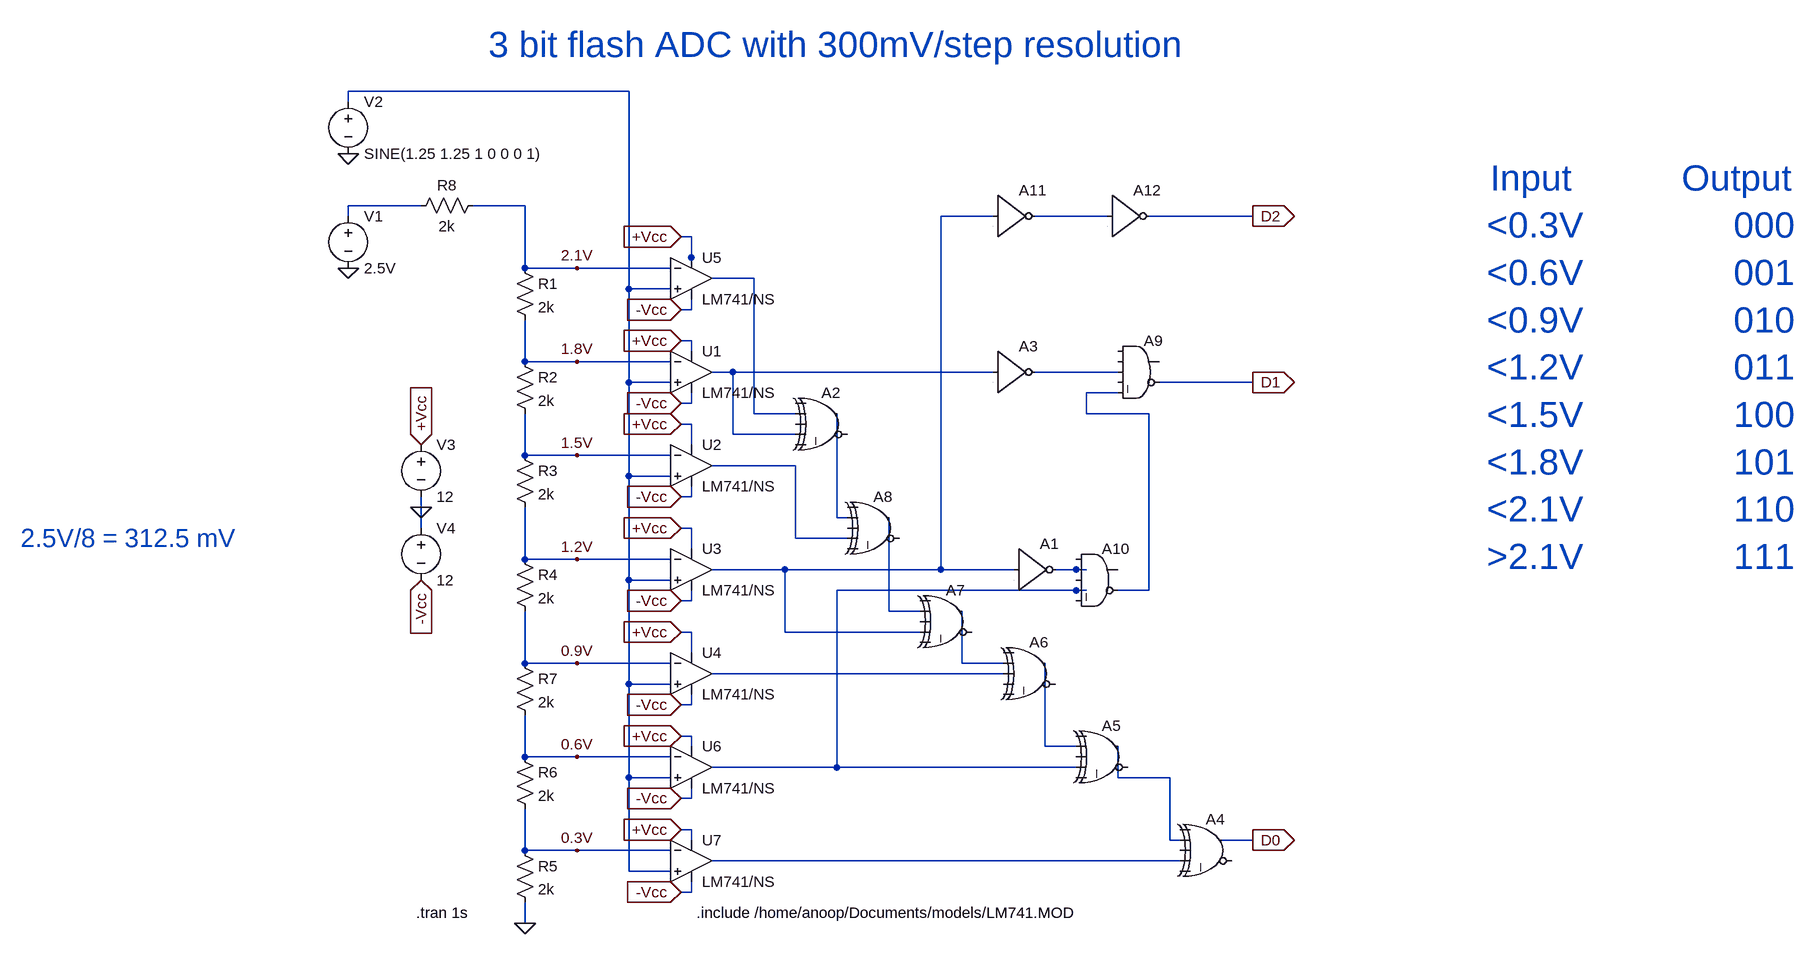
[diagram p0: schematic adc.asc]
adc.asc, the LTspice schematic file:
Version 4
SHEET 1 1920 1124
WIRE 96 -240 -336 -240
WIRE -336 -224 -336 -240
WIRE -224 -64 -336 -64
WIRE -64 -64 -144 -64
WIRE -336 -48 -336 -64
WIRE 656 -48 576 -48
WIRE 832 -48 720 -48
WIRE 1056 -48 896 -48
WIRE 192 -16 176 -16
WIRE 192 16 192 -16
WIRE -64 32 -64 -64
WIRE 16 32 -64 32
WIRE 160 32 16 32
WIRE 192 32 192 16
WIRE 288 48 224 48
WIRE 96 64 96 -240
WIRE 160 64 96 64
WIRE 192 96 192 80
WIRE 192 96 176 96
WIRE 192 144 176 144
WIRE 192 160 192 144
WIRE -64 176 -64 112
WIRE 16 176 -64 176
WIRE 160 176 16 176
WIRE 256 192 224 192
WIRE 656 192 256 192
WIRE 848 192 720 192
WIRE 96 208 96 64
WIRE 160 208 96 208
WIRE 1056 208 912 208
WIRE 848 224 800 224
WIRE 192 240 192 224
WIRE 192 240 176 240
WIRE 288 256 288 48
WIRE 352 256 288 256
WIRE 800 256 800 224
WIRE 896 256 800 256
WIRE 192 272 176 272
WIRE 256 288 256 192
WIRE 352 288 256 288
WIRE 192 304 192 272
WIRE -64 320 -64 256
WIRE 16 320 -64 320
WIRE 160 320 16 320
WIRE 352 336 224 336
WIRE 96 352 96 208
WIRE 160 352 96 352
WIRE 192 384 192 368
WIRE 192 384 176 384
WIRE -224 400 -224 384
WIRE 416 416 416 256
WIRE 432 416 416 416
WIRE -224 432 -224 400
WIRE 192 432 176 432
WIRE 352 448 352 336
WIRE 432 448 352 448
WIRE 192 464 192 432
WIRE -64 480 -64 400
WIRE 16 480 -64 480
WIRE 160 480 16 480
WIRE 336 496 224 496
WIRE 576 496 576 -48
WIRE 576 496 336 496
WIRE 688 496 576 496
WIRE 784 496 752 496
WIRE 800 496 784 496
WIRE 96 512 96 352
WIRE 160 512 96 512
WIRE 784 528 416 528
WIRE 800 528 784 528
WIRE 896 528 896 256
WIRE 896 528 848 528
WIRE 192 544 192 528
WIRE 192 544 176 544
WIRE 496 560 496 416
WIRE 544 560 496 560
WIRE 192 592 176 592
WIRE 336 592 336 496
WIRE 544 592 336 592
WIRE 192 624 192 592
WIRE -64 640 -64 560
WIRE 16 640 -64 640
WIRE 160 640 16 640
WIRE 608 640 608 560
WIRE 672 640 608 640
WIRE 672 656 224 656
WIRE 96 672 96 512
WIRE 160 672 96 672
WIRE 192 704 192 688
WIRE 192 704 176 704
WIRE 192 752 176 752
WIRE 192 768 192 752
WIRE 736 768 736 640
WIRE 784 768 736 768
WIRE -64 784 -64 720
WIRE 16 784 -64 784
WIRE 160 784 16 784
WIRE 416 800 416 528
WIRE 416 800 224 800
WIRE 784 800 416 800
WIRE 96 816 96 672
WIRE 160 816 96 816
WIRE 848 816 848 768
WIRE 928 816 848 816
WIRE 192 848 192 832
WIRE 192 848 176 848
WIRE 192 896 176 896
WIRE 192 912 192 896
WIRE 928 912 928 816
WIRE 944 912 928 912
WIRE 1056 912 1008 912
WIRE -64 928 -64 864
WIRE 16 928 -64 928
WIRE 160 928 16 928
WIRE 944 944 224 944
WIRE 96 960 96 816
WIRE 160 960 96 960
WIRE 192 992 192 976
WIRE 192 992 176 992
WIRE -64 1040 -64 1008
FLAG -64 1040 0
FLAG -336 32 0
FLAG -336 -144 0
FLAG 1056 912 D0
IOPIN 1056 912 Out
FLAG 1056 208 D1
IOPIN 1056 208 Out
FLAG 1056 -48 D2
IOPIN 1056 -48 Out
FLAG 176 -16 +Vcc
IOPIN 176 -16 In
FLAG 176 96 -Vcc
IOPIN 176 96 In
FLAG -224 400 0
FLAG 16 176 1.8V
FLAG 16 320 1.5V
FLAG 16 480 1.2V
FLAG 16 32 2.1V
FLAG 16 640 0.9V
FLAG 16 784 0.6V
FLAG 16 928 0.3V
FLAG 176 144 +Vcc
IOPIN 176 144 In
FLAG 176 272 +Vcc
IOPIN 176 272 In
FLAG 176 432 +Vcc
IOPIN 176 432 In
FLAG 176 592 +Vcc
IOPIN 176 592 In
FLAG 176 752 +Vcc
IOPIN 176 752 In
FLAG 176 896 +Vcc
IOPIN 176 896 In
FLAG -224 304 +Vcc
IOPIN -224 304 In
FLAG 176 240 -Vcc
IOPIN 176 240 In
FLAG 176 384 -Vcc
IOPIN 176 384 In
FLAG 176 544 -Vcc
IOPIN 176 544 In
FLAG 176 704 -Vcc
IOPIN 176 704 In
FLAG 176 848 -Vcc
IOPIN 176 848 In
FLAG 176 992 -Vcc
IOPIN 176 992 In
FLAG -224 512 -Vcc
IOPIN -224 512 In
SYMBOL res -80 16 R0
SYMATTR InstName R1
SYMATTR Value 2k
SYMBOL res -80 160 R0
SYMATTR InstName R2
SYMATTR Value 2k
SYMBOL res -80 304 R0
SYMATTR InstName R3
SYMATTR Value 2k
SYMBOL res -80 464 R0
SYMATTR InstName R4
SYMATTR Value 2k
SYMBOL res -80 912 R0
SYMATTR InstName R5
SYMATTR Value 2k
SYMBOL Digital\\inv 688 432 R0
SYMATTR InstName A1
SYMBOL Digital\\inv 656 128 R0
SYMATTR InstName A3
SYMBOL voltage -336 -64 R0
WINDOW 123 0 0 Left 0
WINDOW 39 0 0 Left 0
SYMATTR InstName V1
SYMATTR Value 2.5V
SYMBOL voltage -336 -240 R0
WINDOW 123 0 0 Left 0
WINDOW 39 0 0 Left 0
SYMATTR InstName V2
SYMATTR Value SINE(1.25 1.25 1 0 0 0 1)
SYMBOL OpAmps\\opamp2 192 -16 R0
SYMATTR InstName U5
SYMATTR Value LM741/NS
SYMBOL OpAmps\\opamp2 192 128 R0
SYMATTR InstName U1
SYMATTR Value LM741/NS
SYMBOL OpAmps\\opamp2 192 272 R0
SYMATTR InstName U2
SYMATTR Value LM741/NS
SYMBOL OpAmps\\opamp2 192 432 R0
SYMATTR InstName U3
SYMATTR Value LM741/NS
SYMBOL voltage -224 288 R0
WINDOW 123 0 0 Left 0
WINDOW 39 0 0 Left 0
SYMATTR InstName V3
SYMATTR Value 12
SYMBOL voltage -224 416 R0
WINDOW 123 0 0 Left 0
WINDOW 39 0 0 Left 0
SYMATTR InstName V4
SYMATTR Value 12
SYMBOL OpAmps\\opamp2 192 592 R0
SYMATTR InstName U4
SYMATTR Value LM741/NS
SYMBOL OpAmps\\opamp2 192 736 R0
SYMATTR InstName U6
SYMATTR Value LM741/NS
SYMBOL OpAmps\\opamp2 192 880 R0
SYMATTR InstName U7
SYMATTR Value LM741/NS
SYMBOL res -80 768 R0
SYMATTR InstName R6
SYMATTR Value 2k
SYMBOL res -80 624 R0
SYMATTR InstName R7
SYMATTR Value 2k
SYMBOL res -128 -80 R90
WINDOW 0 0 56 VBottom 2
WINDOW 3 32 56 VTop 2
SYMATTR InstName R8
SYMATTR Value 2k
SYMBOL Digital\\xor 992 864 R0
SYMATTR InstName A4
SYMBOL Digital\\xor 832 720 R0
SYMATTR InstName A5
SYMBOL Digital\\xor 720 592 R0
SYMATTR InstName A6
SYMBOL Digital\\xor 592 512 R0
SYMATTR InstName A7
SYMBOL Digital\\xor 480 368 R0
SYMATTR InstName A8
SYMBOL Digital\\xor 400 208 R0
SYMATTR InstName A2
SYMBOL Digital\\and 880 128 R0
SYMATTR InstName A9
SYMBOL Digital\\and 816 448 R0
SYMATTR InstName A10
SYMBOL Digital\\inv 656 -112 R0
SYMATTR InstName A11
SYMBOL Digital\\inv 832 -112 R0
SYMATTR InstName A12
TEXT 200 1024 Left 2 !.include /home/anoop/Documents/models/LM741.MOD
TEXT -232 1024 Left 2 !.tran 1s
TEXT -120 -312 Left 5 ;3 bit flash ADC with 300mV/step resolution
TEXT 1656 184 Center 5 ;Input           Output\n<0.3V               000\n<0.6V               001\n<0.9V               010\n<1.2V               011\n<1.5V               100\n<1.8V               101\n<2.1V               110\n>2.1V               111
TEXT -840 448 Left 4 ;2.5V/8 = 312.5 mV

The netlist it stands for:
* adc.asc
R1 2.1V 1.8V 2k
R2 1.8V 1.5V 2k
R3 1.5V 1.2V 2k
R4 1.2V 0.9V 2k
R5 0.3V 0 2k
A1 N003 0 0 0 0 N011 0 0 BUF
A3 N006 0 0 0 0 N007 0 0 BUF
V1 N002 0 2.5V
V2 N001 0 SINE(1.25 1.25 1 0 0 0 1)
XU5 N001 2.1V +Vcc -Vcc N005 LM741/NS  ; pins In+ In- V+ V- OUT
XU1 N001 1.8V +Vcc -Vcc N006 LM741/NS  ; pins In+ In- V+ V- OUT
XU2 N001 1.5V +Vcc -Vcc N009 LM741/NS  ; pins In+ In- V+ V- OUT
XU3 N001 1.2V +Vcc -Vcc N003 LM741/NS  ; pins In+ In- V+ V- OUT
V3 +Vcc 0 12
V4 0 -Vcc 12
XU4 N001 0.9V +Vcc -Vcc N015 LM741/NS  ; pins In+ In- V+ V- OUT
XU6 N001 0.6V +Vcc -Vcc N012 LM741/NS  ; pins In+ In- V+ V- OUT
XU7 N001 0.3V +Vcc -Vcc N018 LM741/NS  ; pins In+ In- V+ V- OUT
R6 0.6V 0.3V 2k
R7 0.9V 0.6V 2k
R8 2.1V N002 2k
A4 0 N017 0 N018 0 0 D0 0 XOR
A5 0 N016 0 N012 0 0 N017 0 XOR
A6 0 N014 N015 0 0 0 N016 0 XOR
A7 0 N013 0 N003 0 0 N014 0 XOR
A8 0 N010 0 N009 0 0 N013 0 XOR
A2 0 N005 0 N006 0 0 N010 0 XOR
A9 0 0 N007 0 N008 D1 0 0 AND
A10 0 N011 0 N012 0 N008 0 0 AND
A11 N003 0 0 0 0 N004 0 0 BUF
A12 N004 0 0 0 0 D2 0 0 BUF
.include /home/anoop/Documents/models/LM741.MOD
.tran 1s
* 3 bit flash ADC with 300mV/step resolution
* Input           Output
* <0.3V               000
* <0.6V               001
* <0.9V               010
* <1.2V               011
* <1.5V               100
* <1.8V               101
* <2.1V               110
* >2.1V               111
* 2.5V/8 = 312.5 mV
.backanno
.end